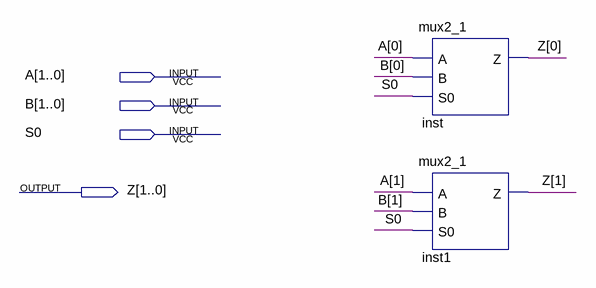
[diagram p0: schematic sheet]
// Quartus schematic mux2_2.bdf as structural Verilog: 2 symbols, 4 pins
module mux2_2 (
  input  [1:0] A,
  input  [1:0] B,
  input  S0,
  output [1:0] Z
);

  mux2_1 inst (.A(A[0]), .B(B[0]), .S0(S0), .Z(Z[0]));
  mux2_1 inst1 (.A(A[1]), .B(B[1]), .S0(S0), .Z(Z[1]));
endmodule
